# EAGLE design EXT_DC_OUT (EAGLE 6.5.0)
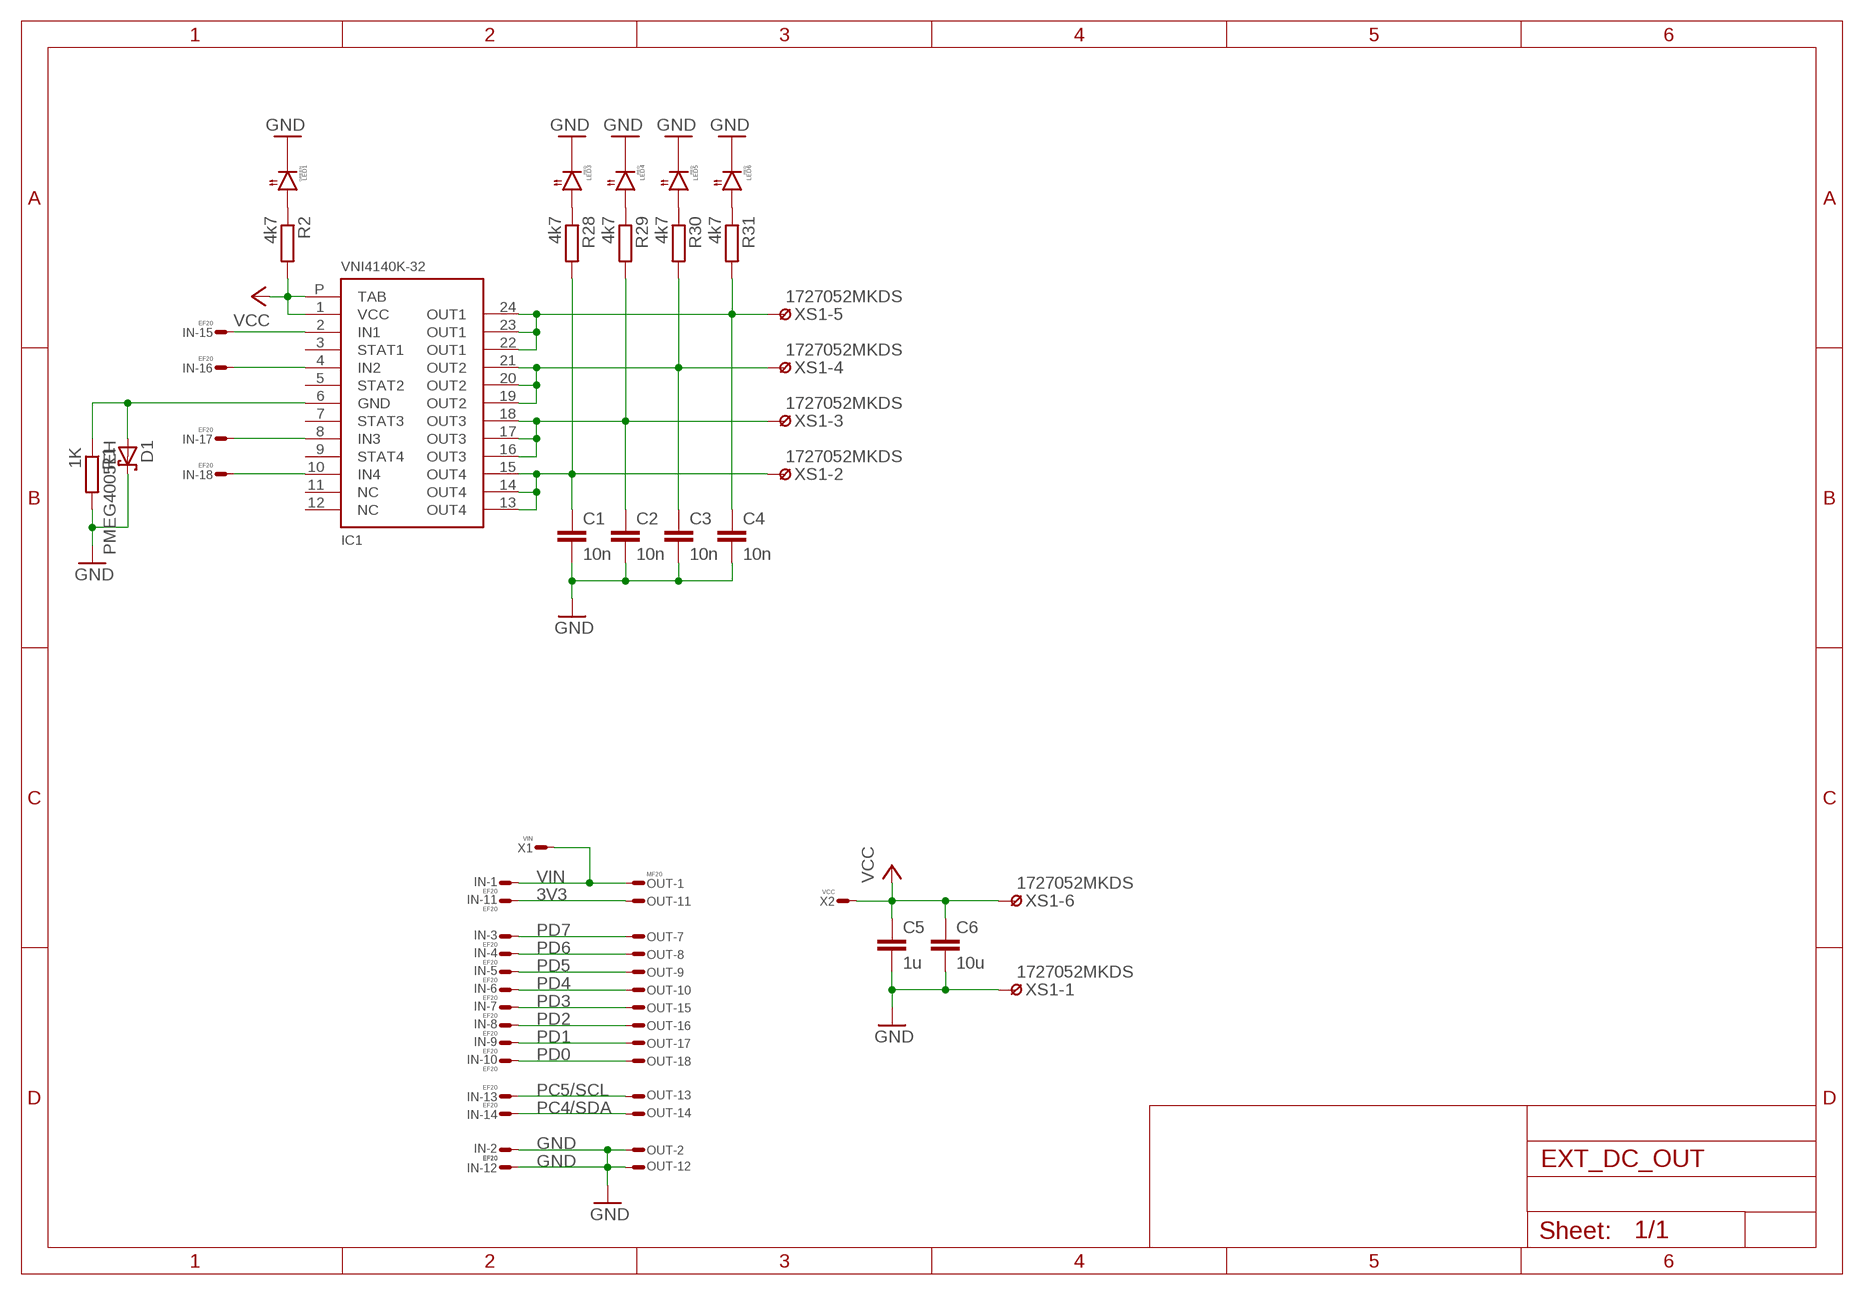
[diagram p0: schematic, sheet 1]

## Parts
C1  10n  C1206  [1206]
C2  10n  C1206  [1206]
C3  10n  C1206  [1206]
C4  10n  C1206  [1206]
C5  1u  C1206  [1206]
C6  10u  CC1210  [C1210]
D1  PMEG4005EH  D-SCHOTKY123  [SOD123]
IC1  VNI4140K-32  VNI4140  [PSSO-24]
IN  EF20  FE20ELSS  [FE10-2WSS]
LED1  GREEN  LED1206  [1206]
LED3  RED  LED1206  [1206]
LED4  RED  LED1206  [1206]
LED5  RED  LED1206  [1206]
LED6  RED  LED1206  [1206]
OUT  MF20  ML20LSE  [ML20LS]
R1  1K  R1206  [1206]
R2  4k7  R1206  [1206]
R28  4k7  R1206  [1206]
R29  4k7  R1206  [1206]
R30  4k7  R1206  [1206]
R31  4k7  R1206  [1206]
X1  VIN  WIREPADT1.6/0.9  [T1.6/0.9]
X2  VCC  WIREPADT1.6/0.9  [T1.6/0.9]
XS1  1727052MKDS  [1727052]

## Nets
3V3: IN.P$11 OUT.P$11
GND: C1.2 C2.2 C3.2 C4.2 C5.2 C6.2 D1.C IN.P$2 IN.P$12 LED1.2(C) LED3.2(C) LED4.2(C) LED5.2(C) LED6.2(C) OUT.P$2 OUT.P$12 R1.2 XS1.1
N$1: IC1.2(IN1) IN.P$15
N$2: IC1.4(IN2) IN.P$16
N$3: IC1.8(IN3) IN.P$17
N$4: IC1.10(IN4) IN.P$18
N$5: C4.1 IC1.22(OUT1) IC1.23(OUT1) IC1.24(OUT1) R31.2 XS1.5
N$6: C3.1 IC1.19(OUT2) IC1.20(OUT2) IC1.21(OUT2) R30.2 XS1.4
N$7: C2.1 IC1.16(OUT3) IC1.17(OUT3) IC1.18(OUT3) R29.2 XS1.3
N$8: C1.1 IC1.13(OUT4) IC1.14(OUT4) IC1.15(OUT4) R28.2 XS1.2
N$9: D1.A IC1.6(GND) R1.1
N$10: LED1.1(A) R2.1
N$12: LED3.1(A) R28.1
N$14: LED4.1(A) R29.1
N$16: LED5.1(A) R30.1
N$18: LED6.1(A) R31.1
PC4/SDA: IN.P$14 OUT.P$14
PC5/SCL: IN.P$13 OUT.P$13
PD0: IN.P$10 OUT.P$18
PD1: IN.P$9 OUT.P$17
PD2: IN.P$8 OUT.P$16
PD3: IN.P$7 OUT.P$15
PD4: IN.P$6 OUT.P$10
PD5: IN.P$5 OUT.P$9
PD6: IN.P$4 OUT.P$8
PD7: IN.P$3 OUT.P$7
VCC: C5.1 C6.1 IC1.1(VCC) IC1.P(TAB) R2.2 X2.1(S) XS1.6
VIN: IN.P$1 OUT.P$1 X1.1(S)
Unconnected: IC1.3(STAT1) IC1.5(STAT2) IC1.7(STAT3) IC1.9(STAT4) IC1.11(NC) IC1.12(NC) IN.P$19 IN.P$20 OUT.P$3 OUT.P$4 OUT.P$5 OUT.P$6 OUT.P$19 OUT.P$20

## Library data of the parts
C1-C6 = RCL:C: Capacitor SMD
D1 = Diode:D-SCHOTKY: Schottky Diode
IC1 = ICs:VNI4140: Quad high-side smart power solid state relay 41V/1.0A/0.08R
IN = Conn:FE20E
LED1 LED3-LED6 = Optic:LED
OUT = Conn:ML20?E: HARTING
R1 R2 R28-R31 = RCL:R: Resistor SMD
X1 X2 = Conn:WIREPAD: Wire PAD connect wire on PCB
XS1 = Conn:1727052: Phoenix Contact PCB Screw Terminal Block. Pitch 3.81

## Board
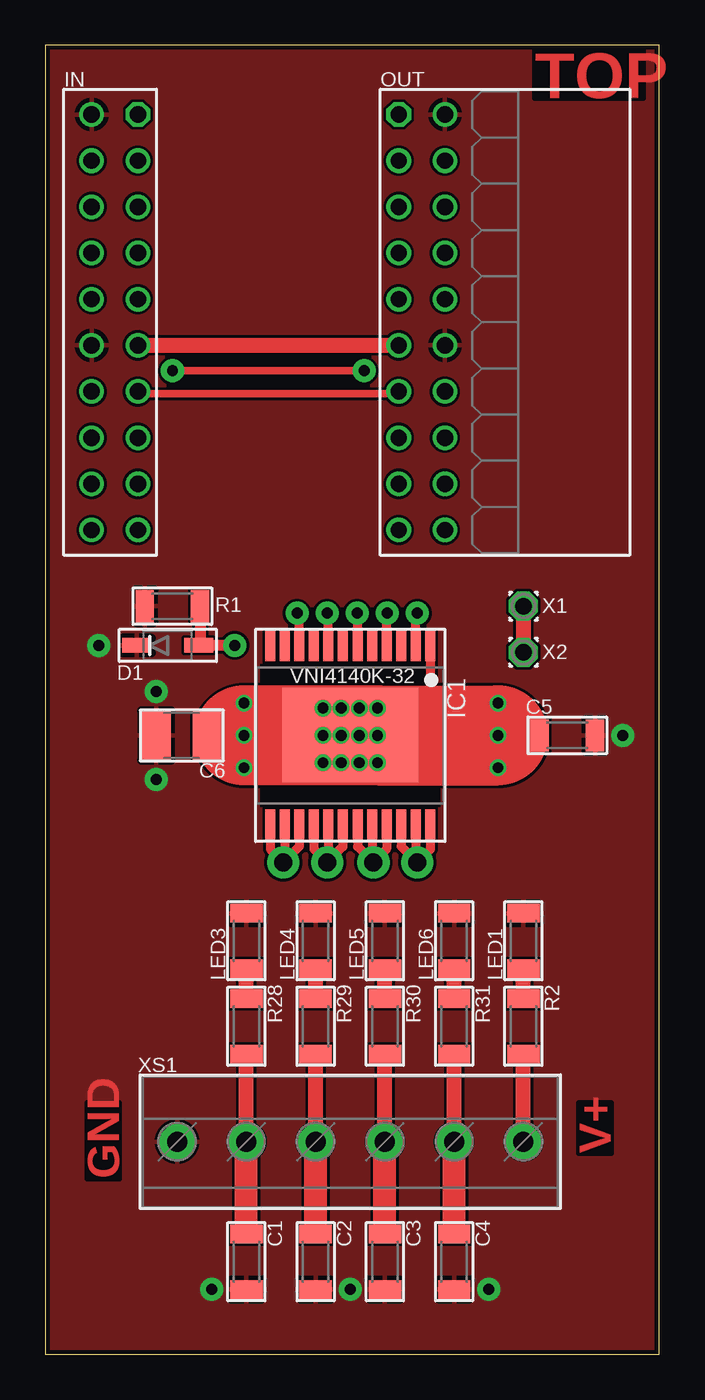
[diagram p1: board, top side]
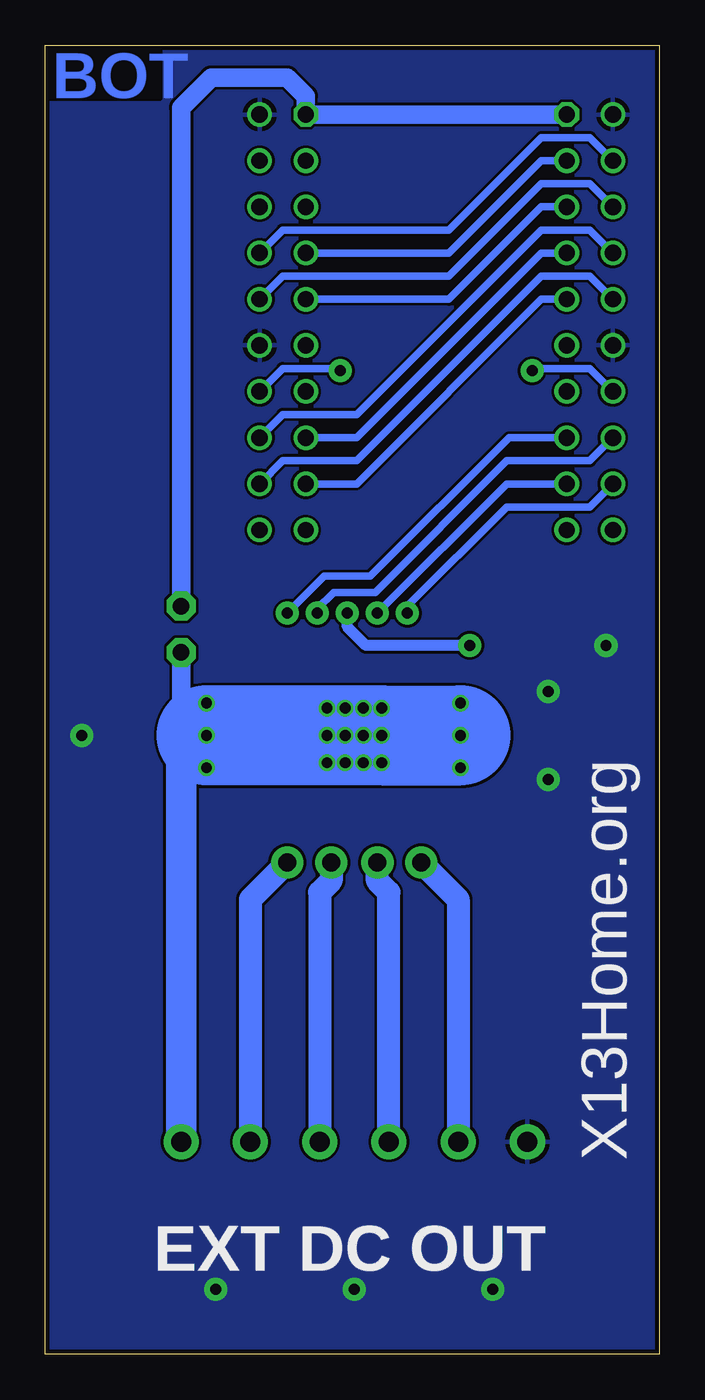
[diagram p2: board, bottom side, seen from below]

Size 33.75 x 72 mm. Coordinates in mm from the lower left corner, seen from the top.
Outline: 0,0 33.75,0 33.75,72 0,72 0,0
Copper layers (1*2*15*16): Top 0.035mm / dielectric 0.2mm / Route2 0.0175mm / dielectric 1.1mm / Route15 0.0175mm / dielectric 0.2mm / Bottom 0.035mm
Design rules "SeeedStudio_DRU_no_angle_20130527": minimum track width 6mil, minimum drill 12mil, track to track 6mil, track to pad 6mil, pad to pad 6mil, via to via 6mil, smd to smd 0mil, copper to edge 10mil, drill to drill 10mil, minimum pad ring 6mil, minimum via ring 6mil, stop-mask expansion 2mil, vias tented up to drill 25mil, thermal gap 10mil
tKeepout: area 0,0 to 33.8,2; area 0,70 to 33.8,72
tRestrict: area 11.8,37 to 20.7,38; area 11.8,30.1 to 21.7,31.1

### Footprints (pad centres in the part's own frame; a part is rotated, then mirrored left to right if it is on the bottom)
1206 = smd 1.016 x 1.778: 1 -1.524,0; 2 1.524,0
C1210 = smd 1.6 x 2.7: 1 -1.4,0; 2 1.4,0
SOD123 = smd 1.6 x 0.8: A 1.7,0; C -1.7,0
PSSO-24 = smd 0.55 x 1.7: 1 -4.4,-4.933; 2 -3.6,-4.933; 3 -2.8,-4.933; 4 -2,-4.933; 5 -1.2,-4.933; 6 -0.4,-4.933; 7 0.4,-4.933; 8 1.2,-4.933; 9 2,-4.933; 10 2.8,-4.933; 11 3.6,-4.933; 12 4.4,-4.933; 13 4.4,4.933; 14 3.6,4.933; 15 2.8,4.933; 16 2,4.933; 17 1.2,4.933; 18 0.4,4.933; 19 -0.4,4.933; 20 -1.2,4.933; 21 -2,4.933; 22 -2.8,4.933; 23 -3.6,4.933; 24 -4.4,4.933 | smd 7.5 x 5.2: P 0,0
FE10-2WSS = drill 0.9 octagon: P$1 -11.43,1.27 | drill 0.9: P$2 -11.43,-1.27; P$3 -8.89,1.27; P$4 -8.89,-1.27; P$5 -6.35,1.27; P$6 -6.35,-1.27; P$7 -3.81,1.27; P$8 -3.81,-1.27; P$9 -1.27,1.27; P$10 -1.27,-1.27; P$11 1.27,1.27; P$12 1.27,-1.27; P$13 3.81,1.27; P$14 3.81,-1.27; P$15 6.35,1.27; P$16 6.35,-1.27; P$17 8.89,1.27; P$18 8.89,-1.27; P$19 11.43,1.27; P$20 11.43,-1.27
ML20LS = drill 0.9 octagon: P$1 -11.43,-1.27 | drill 0.9: P$2 -11.43,1.27; P$3 -8.89,-1.27; P$4 -8.89,1.27; P$5 -6.35,-1.27; P$6 -6.35,1.27; P$7 -3.81,-1.27; P$8 -3.81,1.27; P$9 -1.27,-1.27; P$10 -1.27,1.27; P$11 1.27,-1.27; P$12 1.27,1.27; P$13 3.81,-1.27; P$14 3.81,1.27; P$15 6.35,-1.27; P$16 6.35,1.27; P$17 8.89,-1.27; P$18 8.89,1.27; P$19 11.43,-1.27; P$20 11.43,1.27
T1.6/0.9 = drill 0.914 pad 1.6 octagon: 1 0,0
1727052 = drill 1.1 pad 1.93: 1 -7.62,0; 2 -3.81,0; 3 0,0; 4 3.81,0; 5 7.62,0; 6 11.43,0

### Placement (x,y rotation side)
C1  11.05,5.08 270 top
C2  14.86,5.08 270 top
C3  18.67,5.08 270 top
C4  22.48,5.08 270 top
C5  28.7,34.04 0 top
C6  7.49,34.04 180 top
D1  6.73,38.99 0 top
IC1  16.76,34.04 180 top
IN  3.81,56.77 270 top
LED1  26.29,22.73 90 top
LED3  11.05,22.73 90 top
LED4  14.86,22.73 90 top
LED5  18.67,22.73 90 top
LED6  22.48,22.73 90 top
OUT  20.7,56.77 270 top
R1  6.99,41.15 180 top
R2  26.29,18.03 270 top
R28  11.05,18.03 270 top
R29  14.86,18.03 270 top
R30  18.67,18.03 270 top
R31  22.48,18.03 270 top
X1  26.29,41.15 0 top
X2  26.29,38.61 0 top
XS1  14.86,11.68 0 top

### Tracks (layer width: path | path; a pad name or v marks a point on that pad's centre or on a via)
3V3
  Top 0.813: IN.P$11 OUT.P$11
GND  (via drill 0.6 pad 1.27)
  other vias: 31.75,34.04 2.92,38.99 24.38,3.56 9.14,3.56 16.76,3.56 6.1,36.45 6.1,31.62
  pour Bottom: 0,0.13 33.66,0.13 33.66,71.88 0,71.88
  pour Top: 0,0 33.66,0 33.66,71.88 0,71.88
N$1  (via drill 0.6 pad 1.27)
  Top 0.508: IC1.2 20.36,40.68 v20.45,40.77
  Bottom 0.406: v20.45,40.77 18.41,42.8 15.88,42.8 8.26,50.42 IN.P$15
N$2  (via drill 0.6 pad 1.27)
  Top 0.508: IC1.4 18.76,40.73 v18.8,40.77
  Bottom 0.406: IN.P$16 3.81,49.15 8.38,49.15 15.62,41.91 17.91,41.91 18.8,41.02 v18.8,40.77
N$3  (via drill 0.6 pad 1.27)
  Top 0.508: IC1.8 15.56,40.7 v15.49,40.77
  Bottom 0.406: IN.P$17 8.38,47.88 v15.49,40.77
N$4  (via drill 0.6 pad 1.27)
  Top 0.508: IC1.10 13.96,40.65 v13.84,40.77
  Bottom 0.406: v13.84,40.77 13.84,41.15 8.38,46.61 3.81,46.61 IN.P$18
N$5  (via drill 1 pad 1.78)
  Top 0.508: IC1.23 20.36,27.13 v20.45,27.05 | IC1.22 19.56,27.93 v20.45,27.05 | IC1.24 21.16,27.77 v20.45,27.05
  Top 0.61: C4.1 22.48,7.11
  Top 0.813: XS1.5 R31.2
  Top 1.27: 22.48,7.11 XS1.5
  Bottom 1.27: v20.45,27.05 22.48,25.02 XS1.5
N$6  (via drill 1 pad 1.78)
  Top 0.508: IC1.20 17.96,27.12 v18.03,27.05 | IC1.19 17.16,27.92 v18.03,27.05 | IC1.21 18.76,27.78 v18.03,27.05
  Top 0.61: C3.1 18.67,7.11
  Top 0.813: XS1.4 R30.2
  Top 1.27: 18.67,7.11 XS1.4
  Bottom 1.27: v18.03,27.05 18.03,26.04 18.67,25.4 XS1.4
N$7  (via drill 1 pad 1.78)
  Top 0.508: IC1.17 15.56,27.12 v15.49,27.05 | IC1.18 16.36,27.92 v15.49,27.05 | IC1.16 14.76,27.78 v15.49,27.05
  Top 0.61: C2.1 14.86,7.11
  Top 0.813: XS1.3 R29.2
  Top 1.27: 14.86,7.11 XS1.3
  Bottom 1.27: XS1.3 14.86,25.4 15.49,26.04 v15.49,27.05
N$8  (via drill 1 pad 1.78)
  Top 0.508: IC1.13 12.36,27.77 v13.08,27.05 | IC1.14 13.16,27.13 v13.08,27.05 | IC1.15 13.96,27.93 v13.08,27.05
  Top 0.61: C1.1 11.05,7.11
  Top 0.813: XS1.2 R28.2
  Top 1.27: 11.05,7.11 XS1.2
  Bottom 1.27: v13.08,27.05 11.05,25.02 XS1.2
N$9  (via drill 0.6 pad 1.27)
  Top 0.406: 8.51,39.07 D1.A
  Top 0.508: IC1.6 17.16,40.75 v17.14,40.77
  Top 0.61: v10.41,38.99 D1.A | R1.1 8.51,39.07
  Bottom 0.61: v10.41,38.99 16.13,38.99 17.14,40.01 v17.14,40.77
N$10
  Top 0.813: R2.1 LED1.1
N$12
  Top 0.813: R28.1 LED3.1
N$14
  Top 0.813: R29.1 LED4.1
N$16
  Top 0.813: R30.1 LED5.1
N$18
  Top 0.813: R31.1 LED6.1
PC4/SDA  (via drill 0.6 pad 1.27)
  Top 0.406: v17.53,54.1 v6.99,54.1
  Bottom 0.406: OUT.P$14 20.7,54.23 17.65,54.23 v17.53,54.1 | IN.P$14 3.81,54.23 6.86,54.23 v6.99,54.1
PC5/SCL
  Top 0.406: IN.P$13 5.21,52.83 19.3,52.83 OUT.P$13
PD0
  Bottom 0.406: IN.P$10 3.81,59.31 6.48,59.31 16.64,49.15 20.7,49.15 OUT.P$18
PD1
  Bottom 0.406: IN.P$9 6.48,58.04 16.64,47.88 OUT.P$17
PD2
  Bottom 0.406: IN.P$8 3.81,61.85 6.48,61.85 16.64,51.69 20.7,51.69 OUT.P$16
PD3
  Bottom 0.406: IN.P$7 6.48,60.58 16.64,50.42 OUT.P$15
PD4
  Bottom 0.406: IN.P$6 3.81,64.39 6.48,64.39 11.56,59.31 20.7,59.31 OUT.P$10
PD5
  Bottom 0.406: IN.P$5 6.48,63.12 11.56,58.04 OUT.P$9
PD6
  Bottom 0.406: IN.P$4 3.81,66.93 6.48,66.93 11.56,61.85 20.7,61.85 OUT.P$8
PD7
  Bottom 0.406: IN.P$3 6.48,65.66 11.56,60.58 OUT.P$7
VCC  (via drill 0.6)
  Top 0.406: C6.1 v10.92,34.04 | 21.16,34.04 v24.89,34.04
  Top 0.508: v15.26,32.54 v15.26,34.04 | v18.26,35.54 v17.26,35.54 | v16.26,35.54 v15.26,35.54 | IC1.1 21.16,34.04
  Top 0.61: C5.1 26.67,34.04
  Top 0.813: XS1.6 R2.2 | v10.92,32.26 v10.92,34.04 v10.92,35.81 | v24.89,32.26 v24.89,34.04 v24.89,35.81
  Top 1.27: 26.67,34.04 v24.89,34.04
  Top 5.5: v24.89,34.04 v18.26,34.04 IC1.P v16.26,34.04 v10.92,34.04
  Bottom 0.406: v15.26,32.54 v16.26,32.54 v17.26,32.54 v18.26,32.54 | v18.26,34.04 v18.26,35.54 | v17.26,35.54 v16.26,35.54
  Bottom 1.016: X2.1 26.29,35.43 v24.89,34.04
  Bottom 1.676: XS1.6 26.29,34.04 v24.89,34.04
  Bottom 5.5: v10.92,34.04 v15.26,34.04 v16.26,34.04 v17.26,34.04 v18.26,34.04 v24.89,34.04
VIN
  Top 0.813: X1.1 26.29,38.61
  Bottom 1.016: IN.P$1 OUT.P$1 19.43,69.22 20.45,70.23 24.64,70.23 26.29,68.58 X1.1

### Text on the board
Top: TOP | V+ | GND
Bottom: BOT
bNames: X13Home.org | EXT DC OUT